# Altium schematic sheet ESP32.SchDoc
size B
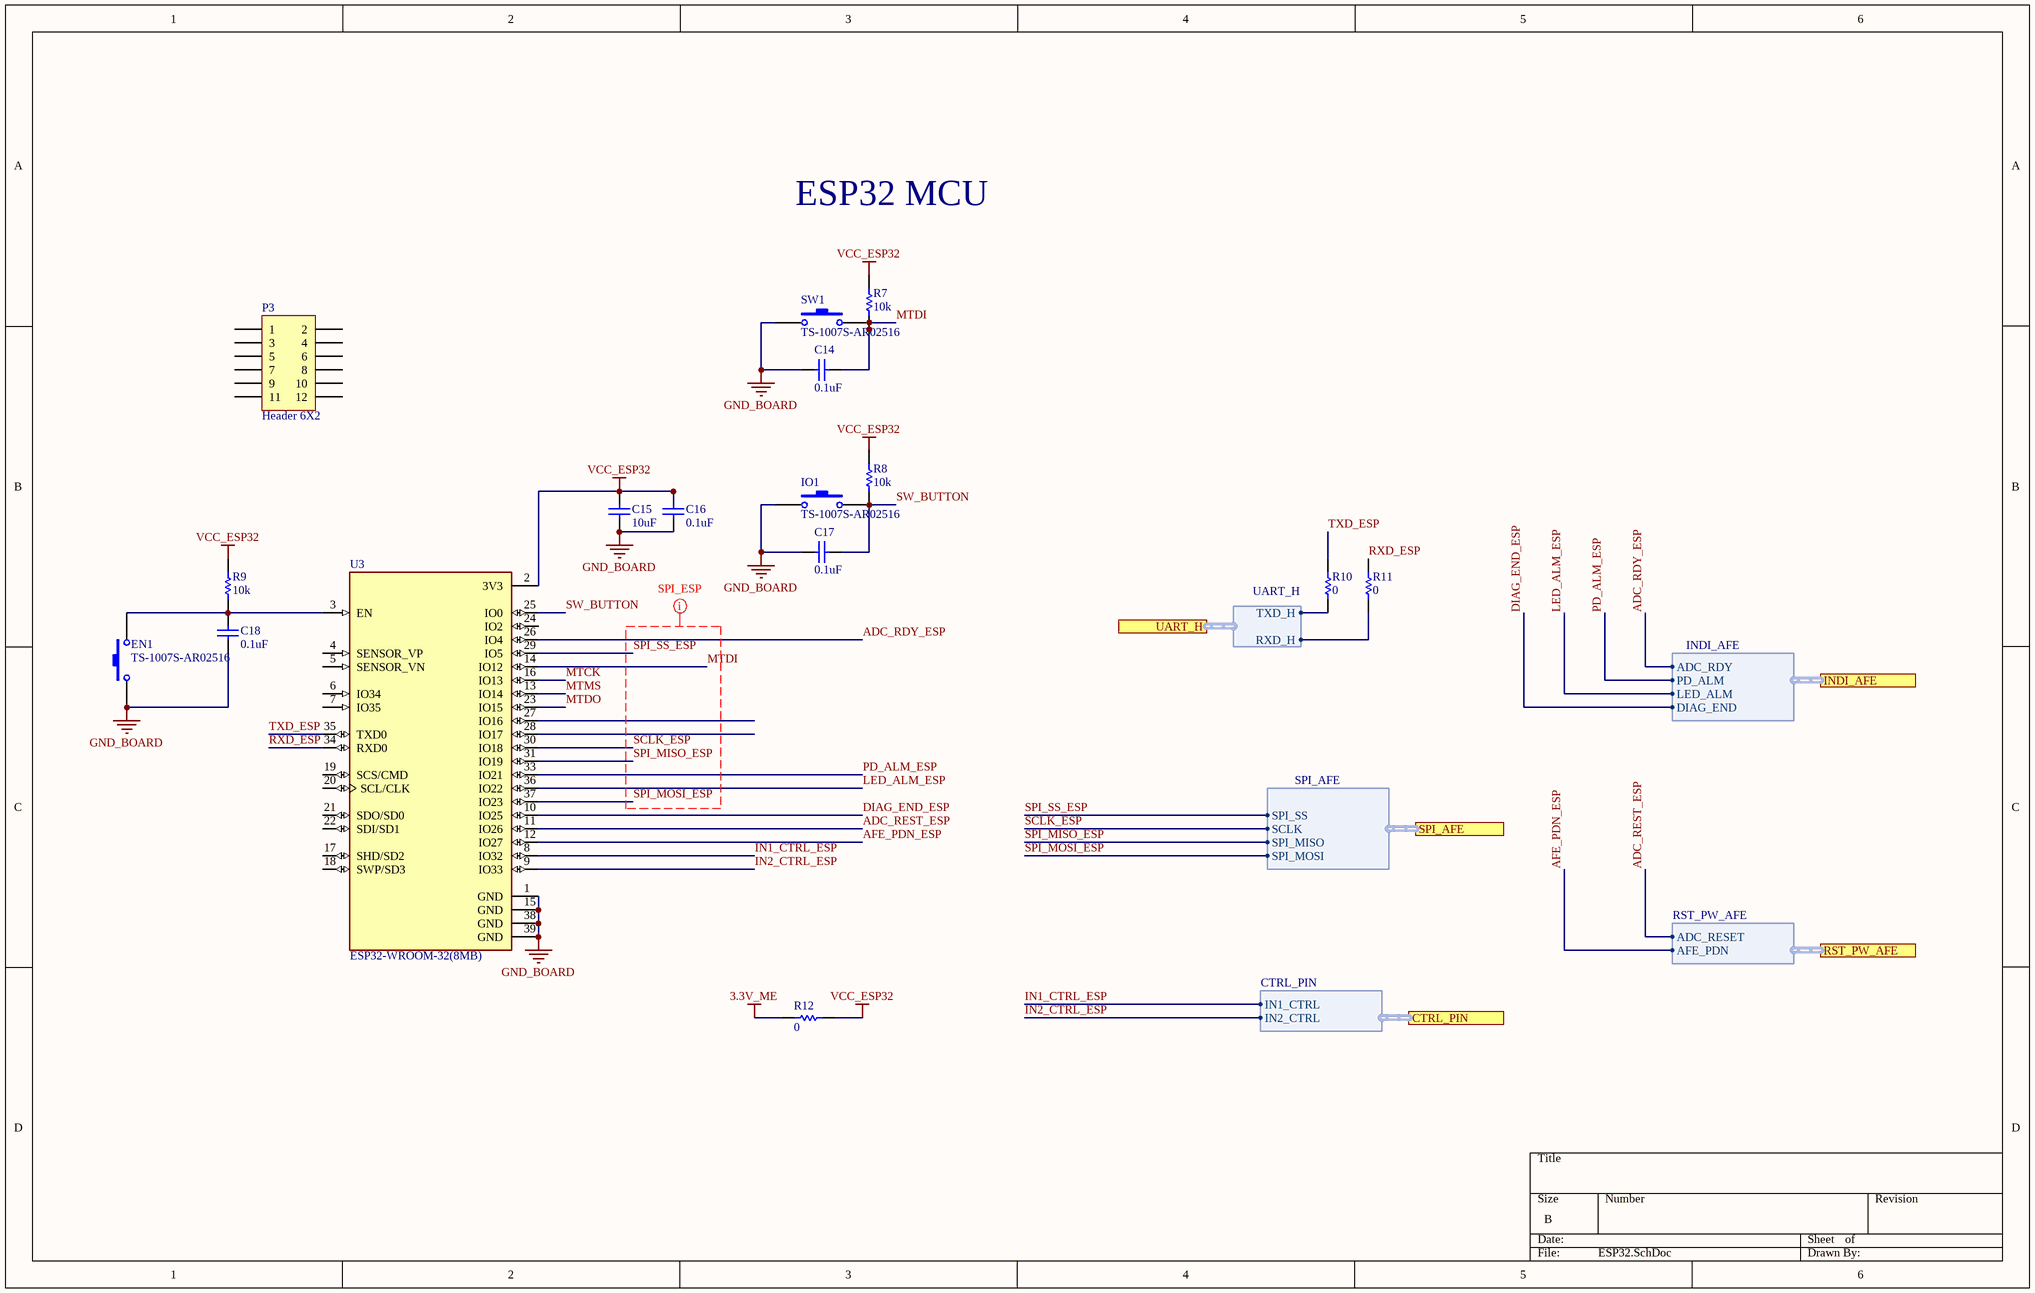
[diagram p0: ESP32.SchDoc]

## Parts
C14  value 0.1uF  [RES-SMD-0603]  (hidden comment: Cap)
C15  value 10uF  [RES-SMD-0603]  (hidden comment: Cap)
C16  value 0.1uF  [RES-SMD-0603]  (hidden comment: Cap)
C17  value 0.1uF  [RES-SMD-0603]  (hidden comment: Cap)
C18  value 0.1uF  [RES-SMD-0603]  (hidden comment: Cap)
EN1  TS-1007S-AR02516  [SW1_SMD]
IO1  TS-1007S-AR02516  [SW1_SMD]
P3  Header 6X2  [HDR2X6]
R7  value 10k  [RES-SMD-0603]  (hidden comment: Res1)
R8  value 10k  [RES-SMD-0603]  (hidden comment: Res1)
R9  value 10k  [RES-SMD-0603]  (hidden comment: Res1)
R10  value 0  [RES-SMD-0603]  (hidden comment: Res1)
R11  value 0  [RES-SMD-0603]  (hidden comment: Res1)
R12  value 0  [RES-SMD-0603]  (hidden comment: Res1)
SW1  TS-1007S-AR02516  [SW1_SMD]
U3  ESP32-WROOM-32(8MB)  [MODULE_ESP32-WROOM-32(8MB)]

## Ports
CTRL_PIN (harness CTRL_PIN), INDI_AFE (harness INDI_AFE), RST_PW_AFE (harness RST_PW_AFE), SPI_AFE (harness SPI_AFE), UART_H (harness UART_H)

## Harnesses
UART_H: TXD_H, RXD_H
SPI_AFE: SPI_SS, SCLK, SPI_MISO, SPI_MOSI
INDI_AFE: ADC_RDY, PD_ALM, LED_ALM, DIAG_END
RST_PW_AFE: ADC_RESET, AFE_PDN
CTRL_PIN: IN1_CTRL, IN2_CTRL

## Nets
3.3V_ME: R12.2
GND_BOARD: C14.2 C15.1 C16.1 C17.2 C18.1 EN1.1 IO1.1 SW1.1 U3.1(GND) U3.15(GND) U3.38(GND) U3.39(GND)
VCC_ESP32: C15.2 C16.2 R7.1 R8.1 R9.1 R12.1 U3.2(3V3)
ADC_RDY_ESP: U3.26(IO4) ; port INDI_AFE.ADC_RDY
ADC_REST_ESP: U3.11(IO26) ; port RST_PW_AFE.ADC_RESET
AFE_PDN_ESP: U3.12(IO27) ; port RST_PW_AFE.AFE_PDN
DIAG_END_ESP: U3.10(IO25) ; port INDI_AFE.DIAG_END
IN1_CTRL_ESP: U3.8(IO32) ; port CTRL_PIN.IN1_CTRL
IN2_CTRL_ESP: U3.9(IO33) ; port CTRL_PIN.IN2_CTRL
LED_ALM_ESP: U3.36(IO22) ; port INDI_AFE.LED_ALM
MTCK: U3.16(IO13)
MTDI: C14.1 R7.2 SW1.2 U3.14(IO12)
MTDO: U3.23(IO15)
MTMS: U3.13(IO14)
PD_ALM_ESP: U3.33(IO21) ; port INDI_AFE.PD_ALM
RXD_ESP: R11.2 U3.34(RXD0)
SCLK_ESP: U3.30(IO18) ; port SPI_AFE.SCLK
SPI_MISO_ESP: U3.31(IO19) ; port SPI_AFE.SPI_MISO
SPI_MOSI_ESP: U3.37(IO23) ; port SPI_AFE.SPI_MOSI
SPI_SS_ESP: U3.29(IO5) ; port SPI_AFE.SPI_SS
SW_BUTTON: C17.1 IO1.2 R8.2 U3.25(IO0)
TXD_ESP: R10.2 U3.35(TXD0)
NetC18_2: C18.2 EN1.2 R9.2 U3.3(EN)
NetR10_1: R10.1 ; port UART_H.TXD_H
NetR11_1: R11.1 ; port UART_H.RXD_H

Not connected (* = marked no-connect by the designer): P3 1 2 3 4 5 6 7 8 9 10 11 12; U3 4(SENSOR_VP) 5(SENSOR_VN) 6(IO34) 7(IO35) 17(SHD/SD2) 18(SWP/SD3) 19(SCS/CMD) 20(SCL/CLK) 21(SDO/SD0) 22(SDI/SD1) 24(IO2) 27(IO16) 28(IO17)

## Layout directives
mark named SPI_ESP: MTDI, SCLK_ESP, SPI_MISO_ESP, SPI_MOSI_ESP, SPI_SS_ESP

## Notes on the sheet
- ESP32 MCU

## Library data of the parts
C14-C18 = Cap: Capacitor; Published: 8-Jun-2000; LatestRevisionDate: 17-Jul-2002; LatestRevisionNote: Re-released for DXP Platform.; PackageReference: RAD-0.3; Publisher: Altium Limited; PackageDescription: Radial Cap, Thru-Hole; 2 Leads; 0.3 in Pin Spacing
EN1 IO1 SW1 = SW-PB: Switch; Published: 24-Mar-1999; LatestRevisionDate: 17-Jul-2002; LatestRevisionNote: Re-released for DXP Platform.; PackageReference: SPST-2; Publisher: Altium Limited; PackageDescription: Switch; 2 Leads
P3 = Header 6X2: Header, 6-Pin, Dual row; LatestRevisionDate: 17-Jul-2002; LatestRevisionNote: Re-released for DXP Platform.; Publisher: Altium Limited
R7-R12 = Res1: Resistor; Published: 8-Jun-2000; LatestRevisionDate: 17-Jul-2002; LatestRevisionNote: Re-released for DXP Platform.; PackageReference: AXIAL-0.3; Publisher: Altium Limited; PackageDescription: Axial Device, Thru-Hole; 2 Leads; 0.3 in Pin Spacing
U3 = ESP32-WROOM-32(8MB): Bluetooth, WiFi 802.11b/g/n, Bluetooth v4.2 + EDR, Class 1, 2 and 3 Transceiver Module 2.4GHz ~ 2.5GHz Integrated, Chip Surface Mount; MF: Espressif Systems; MP: ESP32-WROOM-32 _8MB_; SnapEDA_Link: https://www.snapeda.com/parts/ESP32-WROOM-32%20%288MB%29/Espressif%20Systems/view-part/4301170/?ref=snap; Price: None; Package: Module Espressif Systems; Value: *; Availability: Unavailable